# EAGLE design avr_switch_v09 (EAGLE 7.2.0)
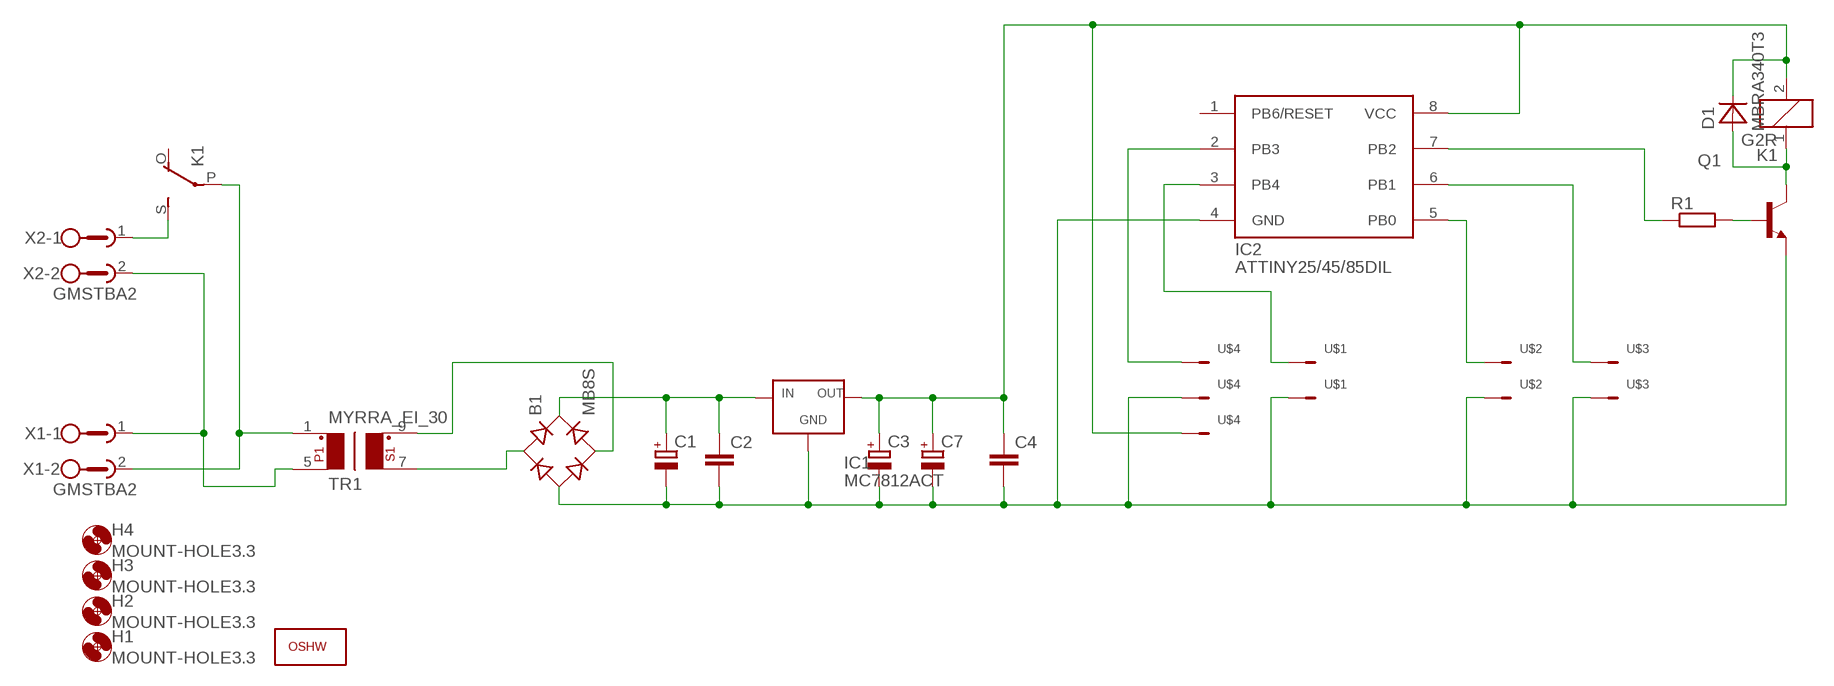
[diagram p0: schematic, sheet 1]

## Parts
B1  MB8S  [SOIC-4]
C1  CPOL-EUE5-10.5  [E5-10,5]
C2  C-EUC0805  [C0805]
C3  CPOL-EUCT6032  [CT6032]
C4  C-EUC0805  [C0805]
C7  CPOL-EUD/7343-31W  [D/7343-31W]
D1  MBRA340T3  [SMA]
H1  MOUNT-HOLE3.3  [3,3]
H2  MOUNT-HOLE3.3  [3,3]
H3  MOUNT-HOLE3.3  [3,3]
H4  MOUNT-HOLE3.3  [3,3]
IC1  MC7812ACT  [TO220V]
IC2  ATTINY25/45/85DIL  [DIL08]
K1  G2R  [G2R]
Q1  BC548-NPN-TO92-CBE  [TO92-CBE]
R1  R-EU_R1206  [R1206]
TR1  MYRRA_EI_30  [MYRRA-EI30]
U$1  MOLEX-VERT-KK-2-  [MOLEX-KK-VERT-2PIN]
U$2  MOLEX-VERT-KK-2-  [MOLEX-KK-VERT-2PIN]
U$3  MOLEX-VERT-KK-2-  [MOLEX-KK-VERT-2PIN]
U$4  MOLEX-VERT-KK-3-3PIN  [MOLEX-KK-VERT-3PIN]
U$5  OSHWOSHW_TOP  [OSHW_F]
X1  GMSTBA2  [GMSTBA2]
X2  GMSTBA2  [GMSTBA2]

## Nets
GND: B1.- C1.- C2.2 C3.- C4.2 C7.- IC1.2(GND) IC2.4(GND) Q1.E U$1.1 U$2.1 U$3.1 U$4.2
N$1: IC2.7(PB2) R1.1
N$2: B1.~1(AC1) TR1.7
N$3: B1.~2(AC2) TR1.9
N$4: IC2.3(PB4) U$1.2
N$5: IC2.5(PB0) U$2.2
N$6: IC2.6(PB1) U$3.2
N$9: Q1.B R1.2
N$10: K1.S(2:S) X2.1
N$11: B1.+ C1.+ C2.1 IC1.1(IN)
N$13: TR1.5 X1.1 X2.2
N$14: K1.P(2:P) TR1.1 X1.2
N$16: IC2.2(PB3) U$4.3
RELN: D1.A K1.1 Q1.C
VCC: C3.+ C4.1 C7.+ D1.C IC1.3(OUT) IC2.8(VCC) K1.2 U$4.1
Unconnected: IC2.1(PB6/RESET) K1.O(2:O)

## Library data of the parts
B1 = rectifier:MB*S: Bridge Rectifier Source: http://www.fairchildsemi.com/ds/MB/MB6S.pdf
C1 C3 C7 = resistor:CPOL-EU: POLARIZED CAPACITOR, European symbol
C2 C4 = resistor:C-EU: CAPACITOR, European symbol
D1 = diode:MBRA340T3: Surface Mount Schottky Power Rectifier Source: http://www.onsemi.com/pub_link/Collateral/MBRA340T3-D.PDF
H1-H4 = holes:MOUNT-HOLE: MOUNTING HOLE with drill center marker
IC1 = 1a:MC7812ACT
IC2 = 1a:ATTINY25/45/85
K1 = relay:G2R: RELAY 1 x switch, Omron; OC_FARNELL: 1569185; OC_NEWARK: unknown
Q1 = transistor:*-NPN-: NPN Transistror BF959 corrected 2008.03.06
R1 = resistor:R-EU_: RESISTOR, European symbol
TR1 = 1a:MYRRA_EI_30
U$1-U$3 = 1a:MOLEX-VERT-KK-2-
U$4 = 1a:MOLEX-VERT-KK-3-
U$5 = 1a:OSHW
X1 X2 = con-phoenix-762:GMSTBA2: PHOENIX; MF: FARNELL; MPN: 1757242; OC_FARNELL: 3705171; OC_NEWARK: 71C4161

## Board
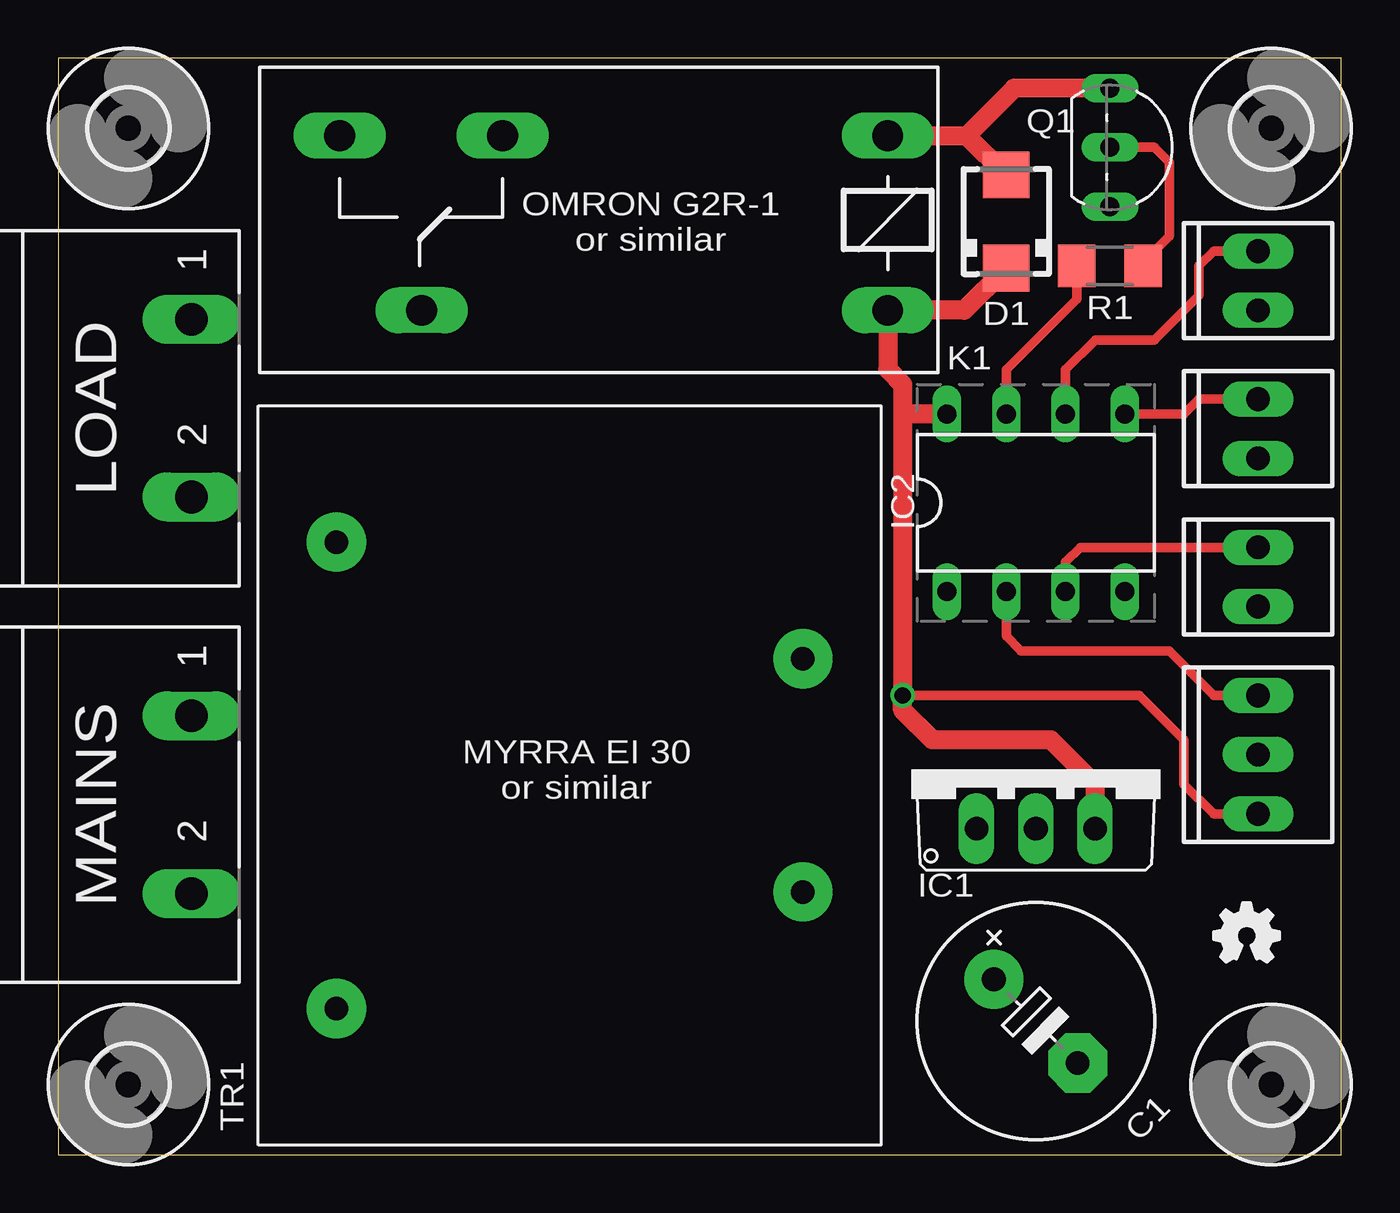
[diagram p1: board, top side]
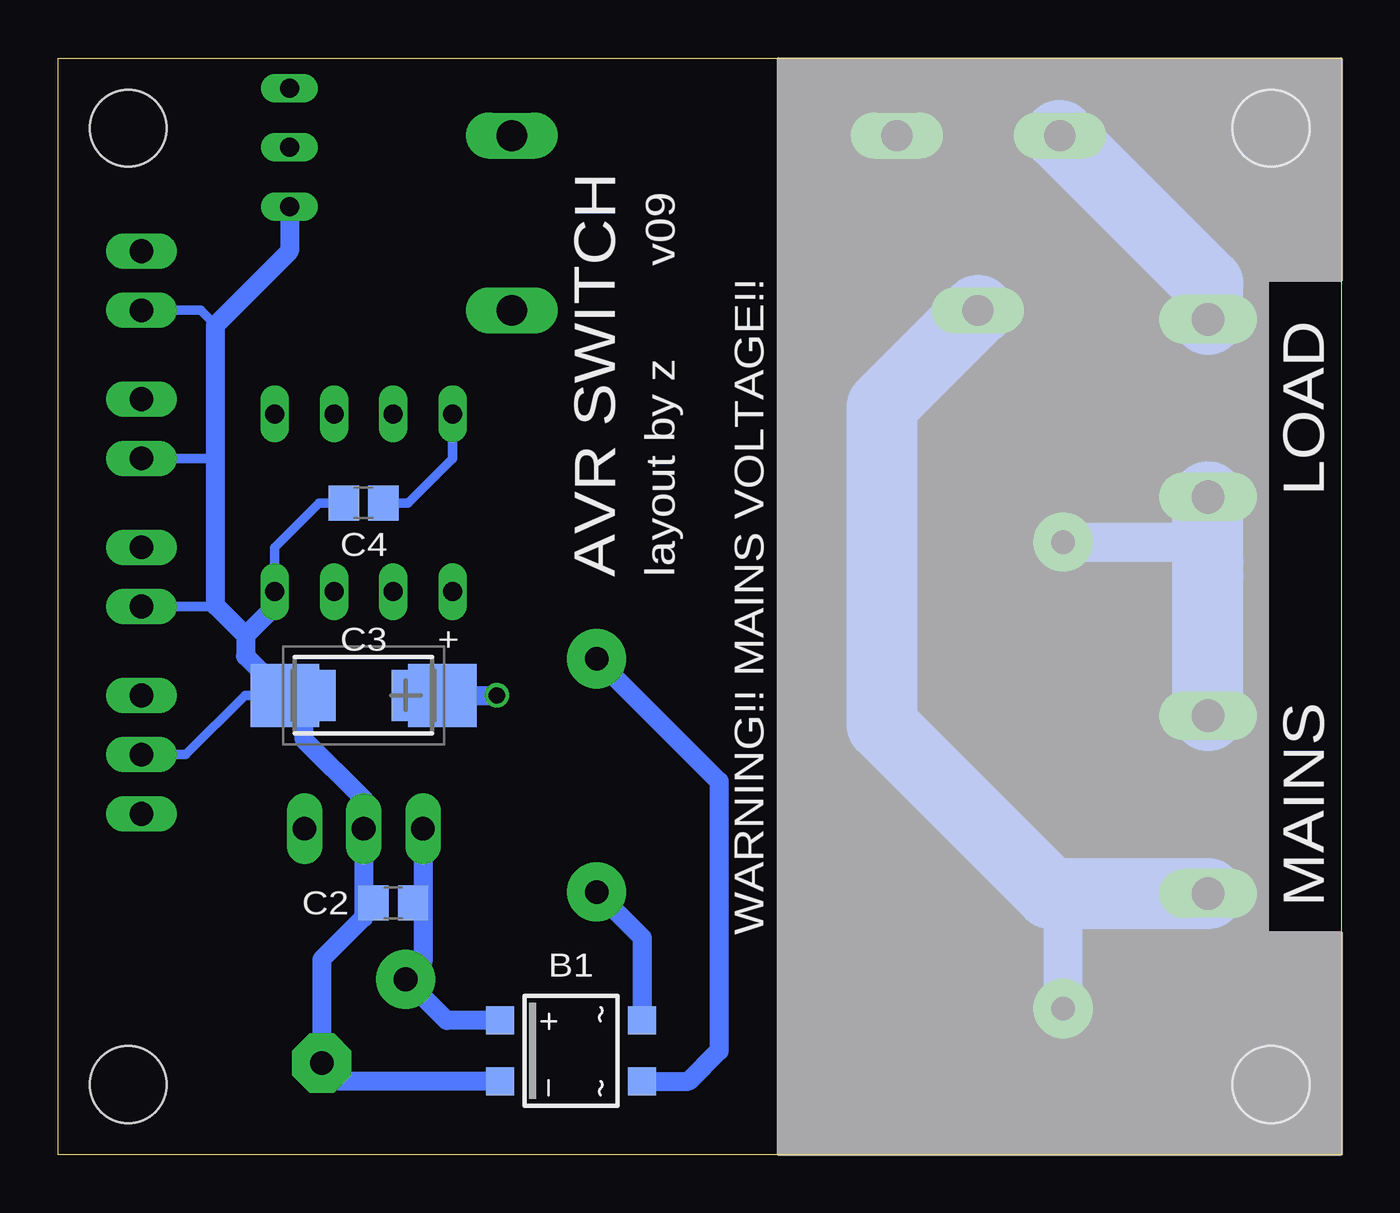
[diagram p2: board, bottom side, seen from below]

Size 55 x 47 mm. Coordinates in mm from the lower left corner, seen from the top.
Outline: 0,0 55,0 55,47 0,47 0,0
Copper layers (1*16): Top 0.0356mm / dielectric 1.5011mm / Bottom 0.0356mm
Design rules "oshpark-2layer": minimum track width 6mil, minimum drill 13mil, track to track 6mil, track to pad 6mil, pad to pad 6mil, via to via 6mil, smd to smd 6mil, copper to edge 15mil, drill to drill 6mil, minimum pad ring 7mil, minimum via ring 7mil, stop-mask expansion 4mil, vias tented up to drill 0mil, thermal gap 10mil

### Footprints (pad centres in the part's own frame; a part is rotated, then mirrored left to right if it is on the bottom)
SOIC-4 = smd 1.2 x 1.2: + 1.3,3.05; - -1.3,3.05; ~1 -1.3,-3.05; ~2 1.3,-3.05
E5-10,5 = drill 1.016 pad 2.54: + -2.54,0 | drill 1.016 pad 2.54 octagon: - 2.54,0
C0805 = smd 1.3 x 1.5: 1 -0.85,0; 2 0.85,0
CT6032 = smd 2.6 x 2.2: + 2.5,0; - -2.5,0
D/7343-31W = smd 2.95 x 2.7: + 3.375,0; - -3.375,0
SMA = smd 2 x 2: A 2,0; C -2,0
3,3 = hole 3.3: 0,0
TO220V = drill 1.016 long: 1 -2.54,-2.54; 2 0,-2.54; 3 2.54,-2.54
DIL08 = drill 0.813 long: 1 -3.81,-3.81; 2 -1.27,-3.81; 3 1.27,-3.81; 4 3.81,-3.81; 5 3.81,3.81; 6 1.27,3.81; 7 -1.27,3.81; 8 -3.81,3.81
G2R = drill 1.321 long: 1 -2.54,-3.683; 2 -2.54,3.81; O 13.97,-3.683; P 17.45,3.81; S 20.955,-3.683
TO92-CBE = drill 0.813 long: B 0,0; C -2.54,0; E 2.54,0
R1206 = smd 1.6 x 1.803: 1 -1.422,0; 2 1.422,0
MYRRA-EI30 = drill 1 pad 2.54: 1 -10,10; 5 10,10; 7 5,-10; 9 -5,-10
MOLEX-KK-VERT-2PIN = drill 1.016 long: 1 0,0; 2 0,2.54
MOLEX-KK-VERT-3PIN = drill 1.016 long: 1 0,0; 2 0,2.54; 3 0,5.08
GMSTBA2 = drill 1.397 long: 1 -3.81,5.08; 2 3.81,5.08

### Placement (x,y rotation side)
B1  33.02,4.45 90 bottom
C1  41.91,5.71 315 top
C2  40.64,10.79 180 bottom
C3  41.91,19.68 0 bottom
C4  41.91,27.94 180 bottom
C7  41.91,19.68 0 bottom
D1  40.64,40.01 90 top
H1  3,3 0 top
H2  52,3 0 top
H3  3,44 0 top
H4  52,44 0 top
IC1  41.91,16.51 0 top
IC2  41.91,27.94 0 top
K1  33.02,40.01 180 top
Q1  45.09,43.18 270 top
R1  45.09,38.1 0 top
TR1  21.92,16.26 90 top
U$1  51.44,23.5 0 top
U$2  51.44,29.84 0 top
U$3  51.44,36.2 0 top
U$4  51.44,14.61 0 top
U$5  49.53,8.26 0 top
X1  0.64,15 270 top
X2  0.64,32 270 top

### Tracks (layer width: path | path; a pad name or v marks a point on that pad's centre or on a via)
GND
  Bottom 0.406: U$1.1 48.3,23.5 48.26,23.54 | U$2.1 48.26,29.84 | U$3.1 48.9,36.2 48.26,35.56 | C4.2 43.81,27.94 45.72,26.04 IC2.4 | U$4.2 49.53,17.14 46.99,19.68 C7.-
  Bottom 0.813: 46.97,22.25 48.26,23.54 48.26,29.84 48.26,35.56 45.09,38.73 Q1.E | IC2.4 45.72,23.5 46.97,22.25 | 46.97,22.25 46.97,21.37 C7.- C3.- 44.45,19.64 44.45,17.78 41.91,15.24 IC1.2 41.91,10.79 | 41.91,10.79 41.91,10.16 43.71,8.36 C1.- 42.93,3.15 B1.- | C2.2 41.91,10.79
N$1
  Top 0.406: IC2.7 40.64,33.66 43.66,36.68 R1.1
N$2
  Bottom 0.813: B1.~1 27.97,3.15 26.67,4.45 26.67,16.01 TR1.7
N$3
  Bottom 0.813: TR1.9 29.97,9.31 B1.~2
N$4
  Top 0.406: U$1.2 43.81,26.04 43.18,25.4 IC2.3
N$5
  Top 0.406: U$2.2 48.9,32.38 48.26,31.75 IC2.5
N$6
  Top 0.406: U$3.2 49.53,38.73 48.9,38.1 48.9,36.83 46.99,34.92 44.45,34.92 43.18,33.66 IC2.6
N$9
  Top 0.406: Q1.B 46.99,43.18 47.62,42.55 47.62,39.37 46.51,38.25 R1.2
N$10
  Bottom 3.048: X2.1 5.71,37.34 K1.S
N$11
  Bottom 0.813: IC1.1 39.37,10.79 | 39.37,10.79 39.37,8.26 C1.+ 38.35,5.75 B1.+ | C2.1 39.37,10.79
N$13
  Bottom 1.676: TR1.5 5.71,26.26 5.71,25.4
  Bottom 1.778: 5.71,26.51 5.71,25.4
  Bottom 3.048: X1.1 5.71,24.77 5.71,25.4 X2.2
N$14
  Bottom 1.676: TR1.1 11.92,11.19 10.16,11.19
  Bottom 1.778: 12.22,11.19 10.16,11.19
  Bottom 3.048: K1.P 19.68,32.08 19.68,18.41 12.46,11.19 10.16,11.19 X1.2
N$16
  Top 0.406: U$4.3 49.53,19.68 47.62,21.59 41.27,21.59 40.64,22.23 IC2.2
RELN
  Top 0.813: K1.1 38.96,43.69 | Q1.C 40.99,45.72 38.96,43.69 | 38.96,43.69 D1.A
VCC  (via drill 0.7)
  Top 0.406: U$4.1 49.53,14.61 48.26,15.88 48.26,17.78 46.35,19.68 v36.2,19.68
  Top 0.813: D1.C 38.83,36.2 K1.2 35.56,33.66 36.2,33.02 36.2,31.75 | IC1.3 44.45,15.88 42.55,17.78 37.47,17.78 36.2,19.05 v36.2,19.68 36.2,31.75 | IC2.8 36.2,31.75
  Bottom 0.406: C4.1 40.01,27.94 38.1,29.84 IC2.8
  Bottom 0.813: C3.+ C7.+ v36.2,19.68

### Text on the board
bPlace: +
tNames: OMRON G2R-1 / or similar | LOAD | MYRRA EI 30 / or similar | MAINS
bNames: v09 | LOAD | layout by z | AVR SWITCH | WARNING!! MAINS VOLTAGE!! | MAINS